# Altium schematic sheet 08-Potentiometer.SchDoc
size A
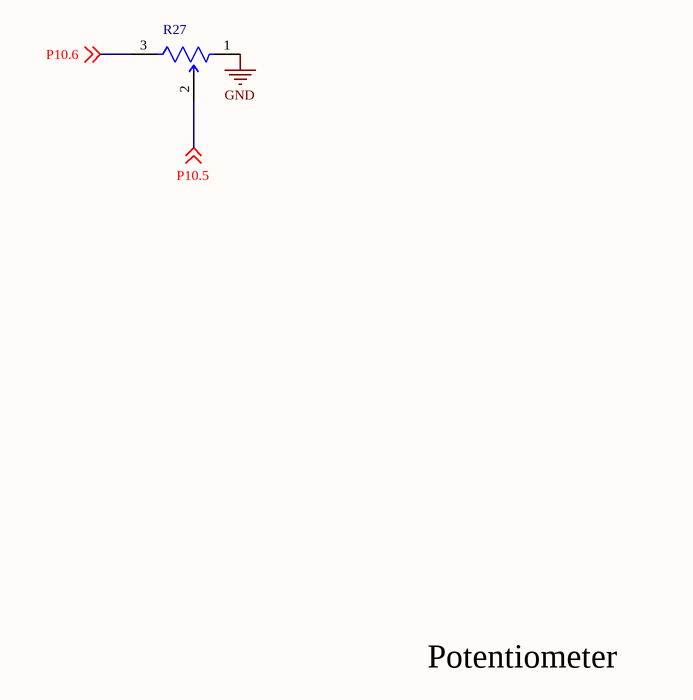
[diagram p0: 08-Potentiometer.SchDoc]

## Parts
R27  3386P-1-103LF  [FP-3386P-MFG]  (value not drawn)

## Nets
GND: R27.1(CCW)
P10.5: R27.2(WIPER) ; off-sheet P10.5
P10.6: R27.3(CW) ; off-sheet P10.6

## Notes on the sheet
- Potentiometer

## Library data of the parts
R27 = CMP-2000-05592-8: TRIMMER 10K OHM 0.5W PC PIN TOP; Manufacturer Series: 3386; Resistance Law: Linear; Voltage Rating: 300V; Actuator Orientation: Vertical; Tolerance: 10%; Number of Turns: 1; Resistance: 100kR; Number of Terminals/Pins: 3; Temperature Coefficient: 100ppm/°C; Max Power Dissipation: 500mW; Actuator Type: SCREW; Radiation Hardening: No; Package Quantity: 100; Type: Potentiometer; Contact Plating: Tin; RoHS Compliant: Yes; Depth: 9.53mm; Terminal Finish: Tin; Taper: Linear; Color: Blue; Number of Pins: 3; Width: 9.53mm; Lead Free: Contains Lead; Reach SVHC Compliant: Yes; Packaging: Rail/Tube; Min Operating Temperature: -55°C; Max Operating Temperature: 125°C; Technology: CERMET; Height: 4.83mm; Series: Trimpot® 3386 - Sealed; Termination: Pin; Resistance Tolerance: 10%; Power Rating: 500mW; Resistor Type: Cermet; Mount: Through Hole; Military Standard: Not; Length: 9.53mm; Weight: 0.03oz